# Altium schematic sheet SLRC_2019_Robot_PCB_Schematic.SchDoc
size A2
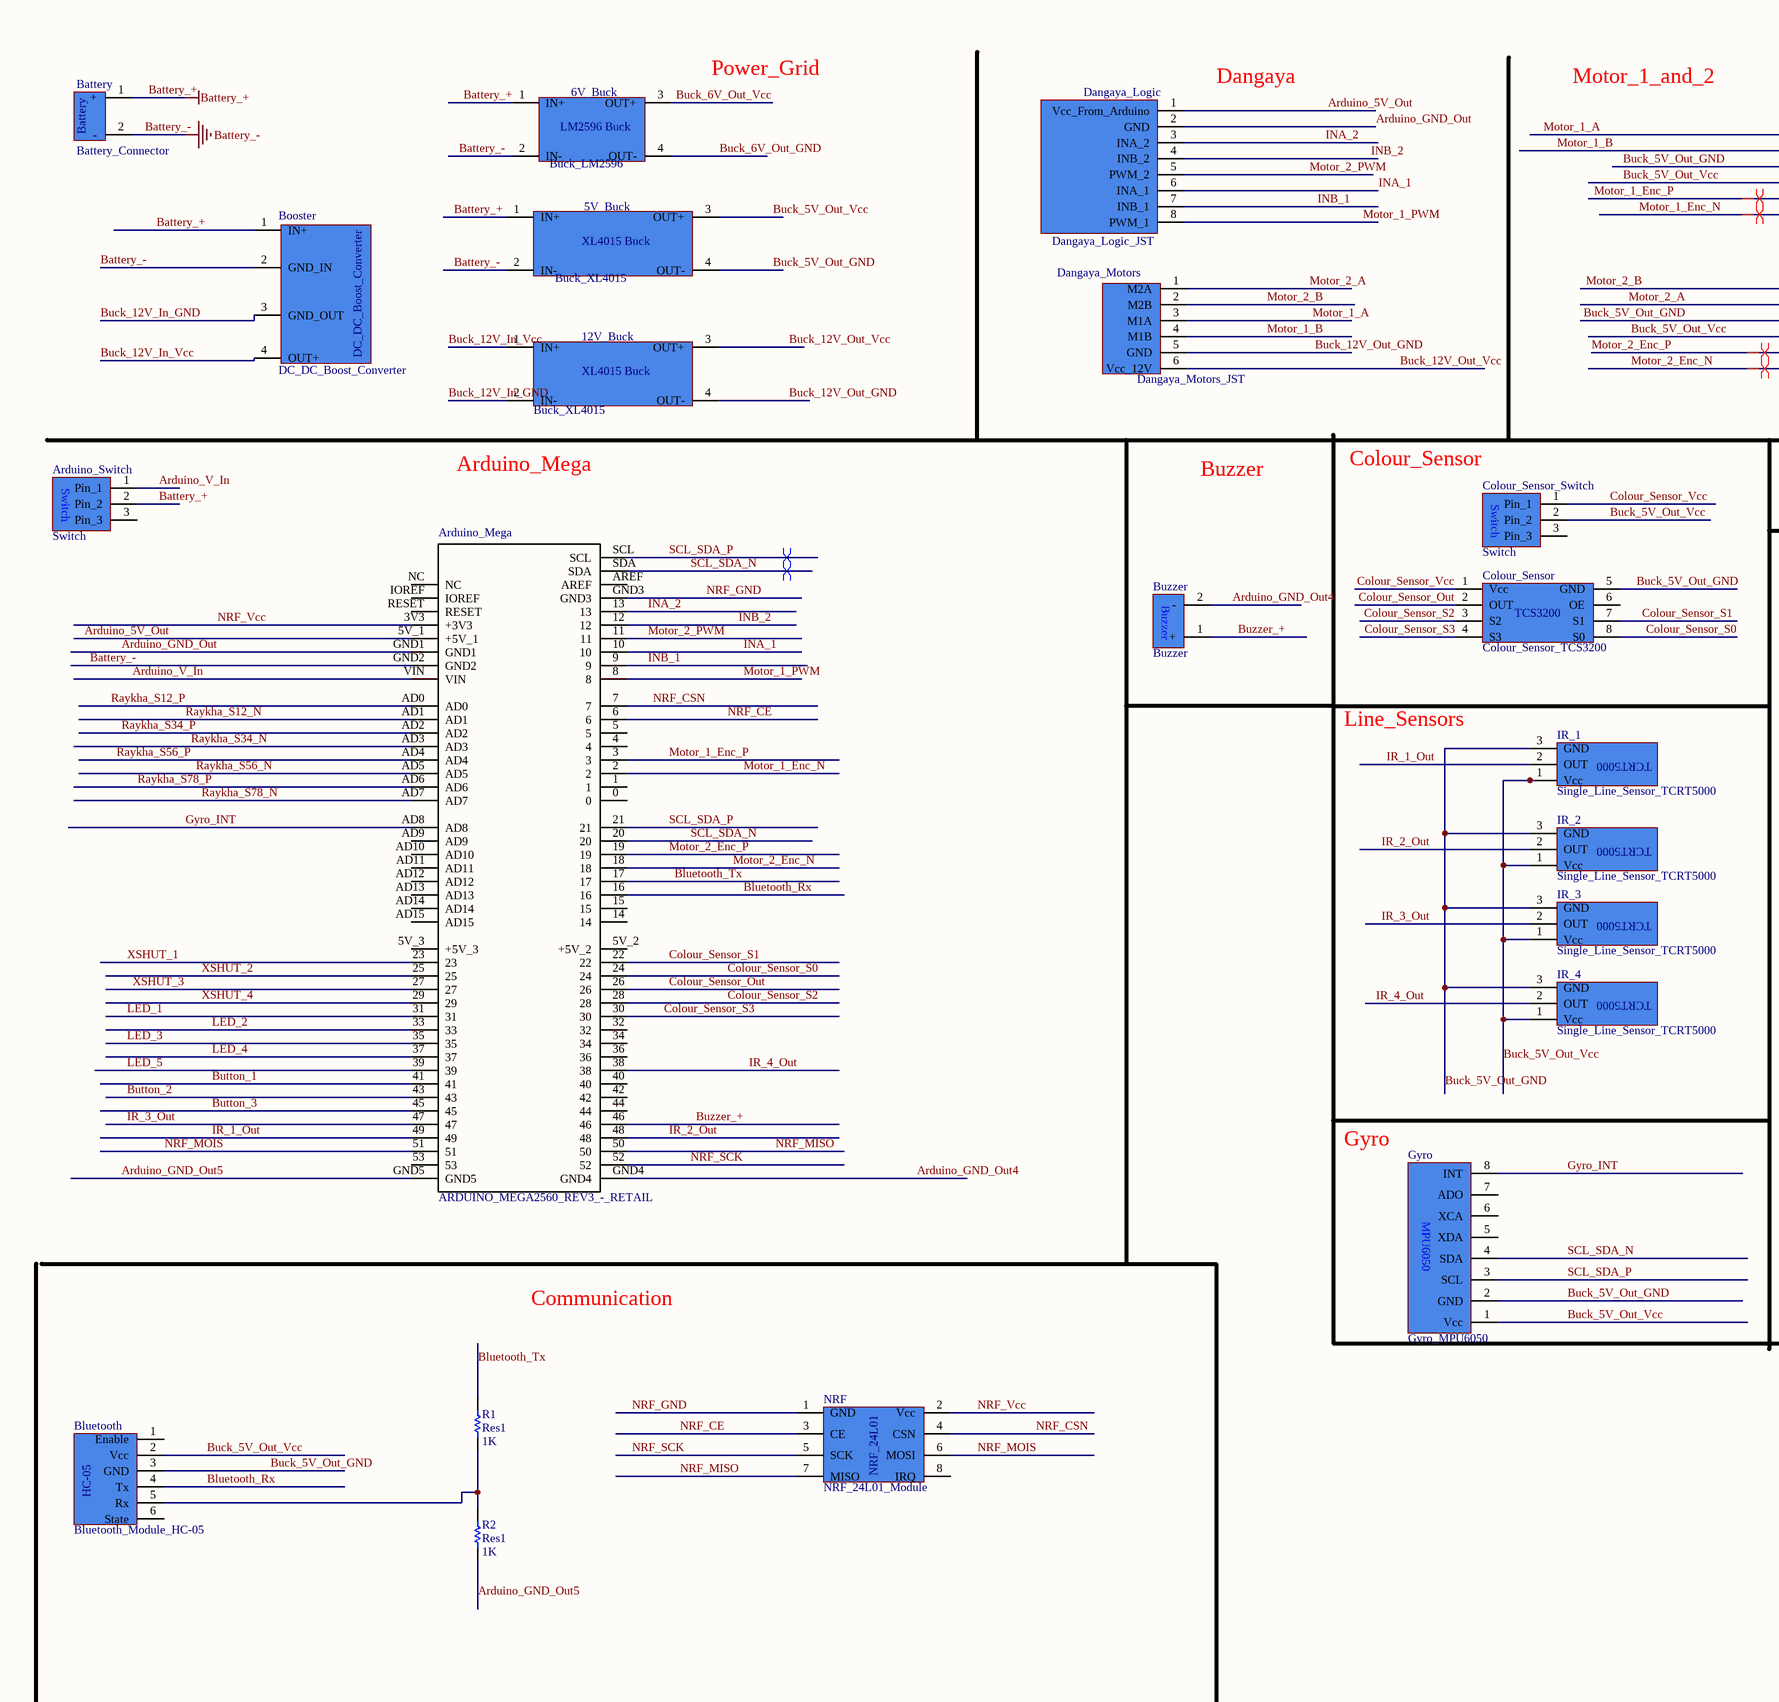
[diagram p0: SLRC_2019_Robot_PCB_Schematic.SchDoc, left]
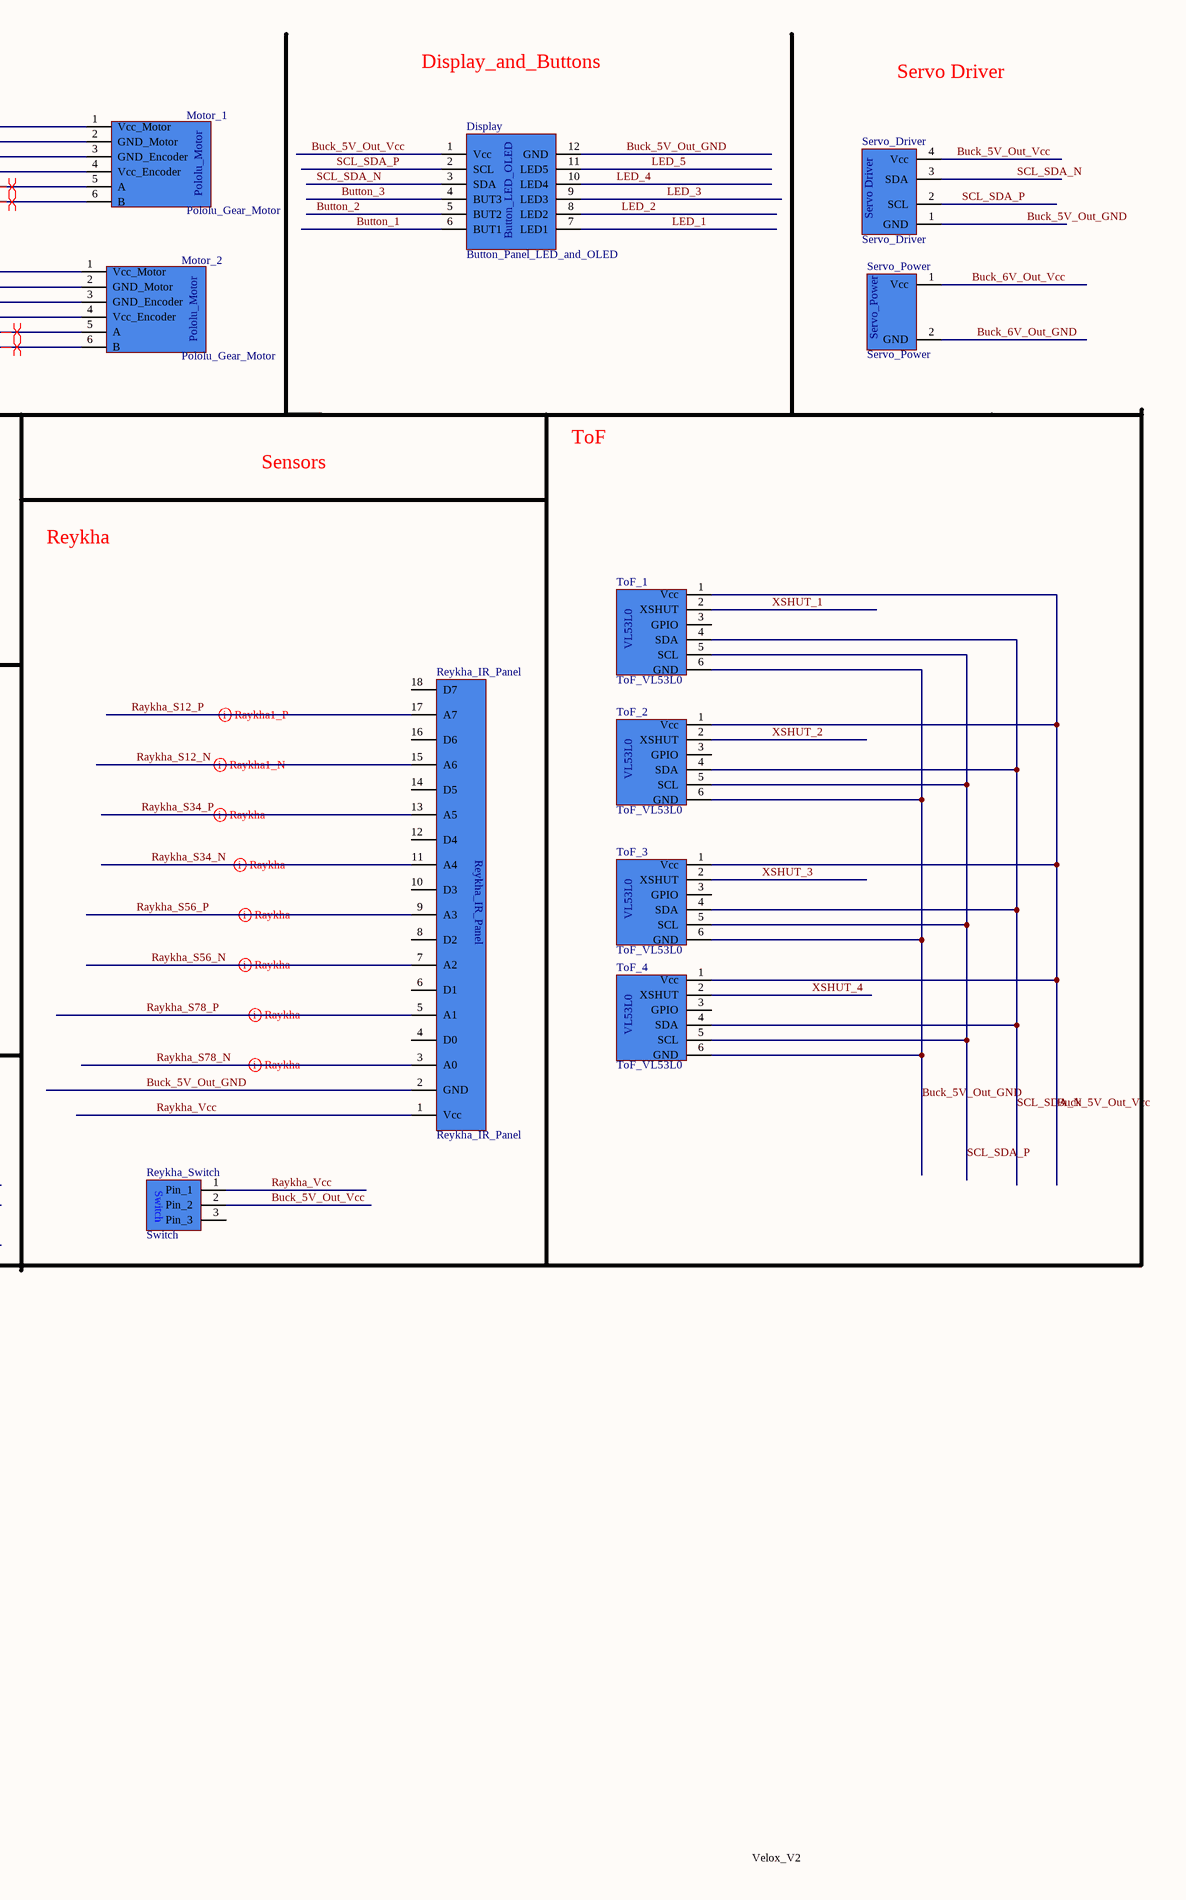
[diagram p1: SLRC_2019_Robot_PCB_Schematic.SchDoc, right]

## Parts
5V_Buck  Buck_XL4015  [Buck_LM4015]
6V_Buck  Buck_LM2596  [Buck_LM2596]
12V_Buck  Buck_XL4015  [Buck_LM4015]
Arduino_Mega  ARDUINO_MEGA2560_REV3_-_RETAIL  [*ARDUINO_MEGA2560_REV3_-_RETAIL_ARDUINO_MEGA2560_REV3_-_RETAIL(Primary)]
Arduino_Switch  Switch  [Switch]
Battery  Battery_Connector  [Battery_Connector]
Bluetooth  Bluetooth_Module_HC-05  [Bluetooth_Module_HC-05]
Booster  DC_DC_Boost_Converter  [DC_DC_Boost_Converter]
Buzzer  Buzzer  [Buzzer]
Colour_Sensor  Colour_Sensor_TCS3200  [Colour_Sensor_TCS3200]
Colour_Sensor_Switch  Switch  [Switch]
Dangaya_Logic  Dangaya_Logic_JST  [Dangaya_Logic_JST]
Dangaya_Motors  Dangaya_Motors_JST  [Dangaya_Motors_JST]
Display  Button_Panel_LED_and_OLED  [Button_Panel_LED_and_OLED]
Gyro  Gyro_MPU6050  [Gyro_MPU6050]
IR_1  Single_Line_Sensor_TCRT5000  [Single_Line_Sensor_TCRT5000]
IR_2  Single_Line_Sensor_TCRT5000  [Single_Line_Sensor_TCRT5000]
IR_3  Single_Line_Sensor_TCRT5000  [Single_Line_Sensor_TCRT5000]
IR_4  Single_Line_Sensor_TCRT5000  [Single_Line_Sensor_TCRT5000]
Motor_1  Pololu_Gear_Motor  [Pololu_Gear_Motor]
Motor_2  Pololu_Gear_Motor  [Pololu_Gear_Motor]
NRF  NRF_24L01_Module  [NRF_24L01]
R1  Res1  value 1K  [AXIAL-0.3]
R2  Res1  value 1K  [AXIAL-0.3]
Reykha_IR_Panel  Reykha_IR_Panel  [Reykha_IR_Panel]
Reykha_Switch  Switch  [Switch]
Servo_Driver  Servo_Driver  [Servo_Driver]
Servo_Power  Servo_Power  [Servo_Power]
ToF_1  ToF_VL53L0  [ToF_VL53L0]
ToF_2  ToF_VL53L0  [ToF_VL53L0]
ToF_3  ToF_VL53L0  [ToF_VL53L0]
ToF_4  ToF_VL53L0  [ToF_VL53L0]

## Nets
Battery_+: 5V_Buck.1(IN+) 6V_Buck.1(IN+) Arduino_Switch.2(Pin_2) Battery.1(+) Booster.1(IN+)
Battery_-: 5V_Buck.2(IN-) 6V_Buck.2(IN-) Arduino_Mega.GND2 Battery.2(-) Booster.2(GND_IN)
Arduino_5V_Out: Arduino_Mega.5V_1(+5V_1) Dangaya_Logic.1(Vcc_From_Arduino)
Arduino_GND_Out: Arduino_Mega.GND1 Dangaya_Logic.2(GND)
Arduino_GND_Out4: Arduino_Mega.GND4 Buzzer.2(-)
Arduino_GND_Out5: Arduino_Mega.GND5 R2.1
Arduino_V_In: Arduino_Mega.VIN Arduino_Switch.1(Pin_1)
Bluetooth_Rx: Arduino_Mega.16 Bluetooth.4(Tx)
Bluetooth_Tx: Arduino_Mega.17 R1.2
Buck_5V_Out_GND: 5V_Buck.4(OUT-) Bluetooth.3(GND) Colour_Sensor.5(GND) Display.12(GND) Gyro.2(GND) IR_1.3(GND) IR_2.3(GND) IR_3.3(GND) IR_4.3(GND) Motor_1.3(GND_Encoder) Motor_2.3(GND_Encoder) Reykha_IR_Panel.2(GND) Servo_Driver.1(GND) ToF_1.6(GND) ToF_2.6(GND) ToF_3.6(GND) ToF_4.6(GND)
Buck_5V_Out_Vcc: 5V_Buck.3(OUT+) Bluetooth.2(Vcc) Colour_Sensor_Switch.2(Pin_2) Display.1(Vcc) Gyro.1(Vcc) IR_1.1(Vcc) IR_2.1(Vcc) IR_3.1(Vcc) IR_4.1(Vcc) Motor_1.4(Vcc_Encoder) Motor_2.4(Vcc_Encoder) Reykha_Switch.2(Pin_2) Servo_Driver.4(Vcc) ToF_1.1(Vcc) ToF_2.1(Vcc) ToF_3.1(Vcc) ToF_4.1(Vcc)
Buck_6V_Out_GND: 6V_Buck.4(OUT-) Servo_Power.2(GND)
Buck_6V_Out_Vcc: 6V_Buck.3(OUT+) Servo_Power.1(Vcc)
Buck_12V_In_GND: 12V_Buck.2(IN-) Booster.3(GND_OUT)
Buck_12V_In_Vcc: 12V_Buck.1(IN+) Booster.4(OUT+)
Buck_12V_Out_GND: 12V_Buck.4(OUT-) Dangaya_Motors.5(GND)
Buck_12V_Out_Vcc: 12V_Buck.3(OUT+) Dangaya_Motors.6(Vcc_12V)
Button_1: Arduino_Mega.41 Display.6(BUT1)
Button_2: Arduino_Mega.43 Display.5(BUT2)
Button_3: Arduino_Mega.45 Display.4(BUT3)
Buzzer_+: Arduino_Mega.46 Buzzer.1(+)
Colour_Sensor_Out: Arduino_Mega.26 Colour_Sensor.2(OUT)
Colour_Sensor_S0: Arduino_Mega.24 Colour_Sensor.8(S0)
Colour_Sensor_S1: Arduino_Mega.22 Colour_Sensor.7(S1)
Colour_Sensor_S2: Arduino_Mega.28 Colour_Sensor.3(S2)
Colour_Sensor_S3: Arduino_Mega.30 Colour_Sensor.4(S3)
Colour_Sensor_Vcc: Colour_Sensor.1(Vcc) Colour_Sensor_Switch.1(Pin_1)
Gyro_INT: Arduino_Mega.AD8 Gyro.8(INT)
INA_1: Arduino_Mega.10 Dangaya_Logic.6(INA_1)
INA_2: Arduino_Mega.13 Dangaya_Logic.3(INA_2)
INB_1: Arduino_Mega.9 Dangaya_Logic.7(INB_1)
INB_2: Arduino_Mega.12 Dangaya_Logic.4(INB_2)
IR_1_Out: Arduino_Mega.49 IR_1.2(OUT)
IR_2_Out: Arduino_Mega.48 IR_2.2(OUT)
IR_3_Out: Arduino_Mega.47 IR_3.2(OUT)
IR_4_Out: Arduino_Mega.38 IR_4.2(OUT)
LED_1: Arduino_Mega.31 Display.7(LED1)
LED_2: Arduino_Mega.33 Display.8(LED2)
LED_3: Arduino_Mega.35 Display.9(LED3)
LED_4: Arduino_Mega.37 Display.10(LED4)
LED_5: Arduino_Mega.39 Display.11(LED5)
Motor_1_A: Dangaya_Motors.3(M1A) Motor_1.1(Vcc_Motor)
Motor_1_B: Dangaya_Motors.4(M1B) Motor_1.2(GND_Motor)
Motor_1_Enc_N: Arduino_Mega.2 Motor_1.6(B)
Motor_1_Enc_P: Arduino_Mega.3 Motor_1.5(A)
Motor_1_PWM: Arduino_Mega.8 Dangaya_Logic.8(PWM_1)
Motor_2_A: Dangaya_Motors.1(M2A) Motor_2.2(GND_Motor)
Motor_2_B: Dangaya_Motors.2(M2B) Motor_2.1(Vcc_Motor)
Motor_2_Enc_N: Arduino_Mega.18 Motor_2.6(B)
Motor_2_Enc_P: Arduino_Mega.19 Motor_2.5(A)
Motor_2_PWM: Arduino_Mega.11 Dangaya_Logic.5(PWM_2)
NRF_CE: Arduino_Mega.6 NRF.3(CE)
NRF_CSN: Arduino_Mega.7 NRF.4(CSN)
NRF_GND: Arduino_Mega.GND3 NRF.1(GND)
NRF_MISO: Arduino_Mega.50 NRF.7(MISO)
NRF_MOIS: Arduino_Mega.51 NRF.6(MOSI)
NRF_SCK: Arduino_Mega.52 NRF.5(SCK)
NRF_Vcc: Arduino_Mega.3V3(+3V3) NRF.2(Vcc)
Raykha_S12_N: Arduino_Mega.AD1 Reykha_IR_Panel.15(A6)
Raykha_S12_P: Arduino_Mega.AD0 Reykha_IR_Panel.17(A7)
Raykha_S34_N: Arduino_Mega.AD3 Reykha_IR_Panel.11(A4)
Raykha_S34_P: Arduino_Mega.AD2 Reykha_IR_Panel.13(A5)
Raykha_S56_N: Arduino_Mega.AD5 Reykha_IR_Panel.7(A2)
Raykha_S56_P: Arduino_Mega.AD4 Reykha_IR_Panel.9(A3)
Raykha_S78_N: Arduino_Mega.AD7 Reykha_IR_Panel.3(A0)
Raykha_S78_P: Arduino_Mega.AD6 Reykha_IR_Panel.5(A1)
Raykha_Vcc: Reykha_IR_Panel.1(Vcc) Reykha_Switch.1(Pin_1)
SCL_SDA_N: Arduino_Mega.20 Arduino_Mega.SDA Display.3(SDA) Gyro.4(SDA) Servo_Driver.3(SDA) ToF_1.4(SDA) ToF_2.4(SDA) ToF_3.4(SDA) ToF_4.4(SDA)
SCL_SDA_P: Arduino_Mega.21 Arduino_Mega.SCL Display.2(SCL) Gyro.3(SCL) Servo_Driver.2(SCL) ToF_1.5(SCL) ToF_2.5(SCL) ToF_3.5(SCL) ToF_4.5(SCL)
XSHUT_1: Arduino_Mega.23 ToF_1.2(XSHUT)
XSHUT_2: Arduino_Mega.25 ToF_2.2(XSHUT)
XSHUT_3: Arduino_Mega.27 ToF_3.2(XSHUT)
XSHUT_4: Arduino_Mega.29 ToF_4.2(XSHUT)
NetBluetooth_5: Bluetooth.5(Rx) R1.1 R2.2

Not connected (* = marked no-connect by the designer): Arduino_Mega 0 1 4 5 5V_2(+5V_2) 5V_3(+5V_3) 14 15 32 34 36 40 42 44 53 AD9 AD10 AD11 AD12 AD13 AD14 AD15 AREF IOREF NC RESET; Arduino_Switch 3(Pin_3); Bluetooth 1(Enable) 6(State); Colour_Sensor 6(OE); Colour_Sensor_Switch 3(Pin_3); Gyro 5(XDA) 6(XCA) 7(ADO); NRF 8(IRQ); Reykha_IR_Panel 4(D0) 6(D1) 8(D2) 10(D3) 12(D4) 14(D5) 16(D6) 18(D7); Reykha_Switch 3(Pin_3); ToF_1 3(GPIO); ToF_2 3(GPIO); ToF_3 3(GPIO); ToF_4 3(GPIO)

## Layout directives
differential pair: Motor_1_Enc_N, Motor_1_Enc_P, Motor_2_Enc_N, Motor_2_Enc_P, Raykha_S12_N, Raykha_S12_P, Raykha_S34_N, Raykha_S34_P, Raykha_S56_N, Raykha_S56_P, Raykha_S78_N, Raykha_S78_P, SCL_SDA_N, SCL_SDA_P

## Notes on the sheet
- Power_Grid
- Dangaya
- Motor_1_and_2
- Display_and_Buttons
- Servo Driver
- Arduino_Mega
- Buzzer
- Colour_Sensor
- Sensors
- ToF
- Reykha
- Line_Sensors
- Gyro
- Communication
- Velox_V2
- (in symbol Bluetooth_Module_HC-05) HC-05
- (in symbol Buck_LM2596) LM2596 Buck
- (in symbol Buck_XL4015) XL4015 Buck
- (in symbol Button_Panel_LED_and_OLED) Button_LED_OLED
- (in symbol Colour_Sensor_TCS3200) TCS3200
- (in symbol Gyro_MPU6050) MPU6050
- (in symbol NRF_24L01_Module) NRF_24L01
- (in symbol Pololu_Gear_Motor) Pololu_Motor
- (in symbol Servo_Driver) Servo Driver
- (in symbol Single_Line_Sensor_TCRT5000) TCRT5000
- (in symbol ToF_VL53L0) VL53L0

## Library data of the parts
Arduino_Mega = ARDUINO_MEGA2560_REV3_-_RETAIL: Dev.kit: Arduino; SPI, TWI, UART; ICSP, USB B, pin strips, supply; MP: ARDUINO MEGA2560 REV3 - RETAIL; Availability: Unavailable; Price: None; SnapEDA_Link: https://www.snapeda.com/parts/ARDUINO%20MEGA2560%20REV3%20-%20RETAIL/Arduino/view-part/?ref=snap; MF: Arduino; Package: None; Value: *
R1 R2 = Res1: Resistor; Published: 8-Jun-2000; LatestRevisionDate: 17-Jul-2002; LatestRevisionNote: Re-released for DXP Platform.; PackageReference: AXIAL-0.3; Publisher: Altium Limited; PackageDescription: Axial Device, Thru-Hole; 2 Leads; 0.3 in Pin Spacing